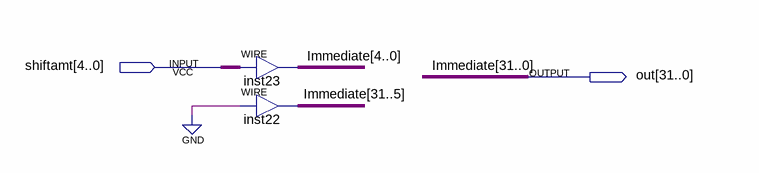
[diagram p0: schematic sheet]
// Quartus schematic ZeroExtend.bdf as structural Verilog: 2 symbols, 2 pins
module ZeroExtend (
  input  [4:0] shiftamt,
  output [31:0] out
);

  assign out[4:0] = shiftamt;  // WIRE inst23
  assign out[31:5] = {27{1'b0}};  // WIRE inst22

  // Other names for the same wires on the sheet: Immediate[31:0] = out
endmodule
